# EAGLE design Flipflop  (EAGLE 9.3.0)
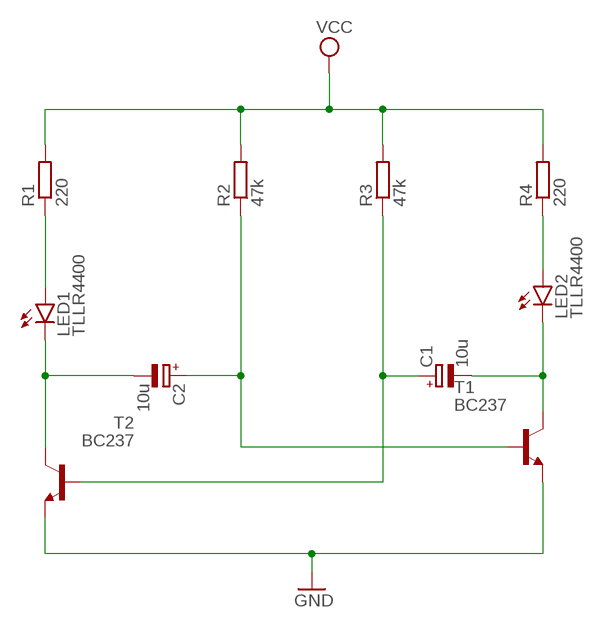
[diagram p0: schematic, sheet 1]

## Parts
C1  10u  CPOL-EU140CLH-1014  [140CLH-1014]
C2  10u  CPOL-EU140CLH-1014  [140CLH-1014]
LED1  TLLR4400  [LED3MM]
LED2  TLLR4400  [LED3MM]
R1  220  R-EU_0207/12  [0207/12]
R2  47k  R-EU_0207/12  [0207/12]
R3  47k  R-EU_0207/12  [0207/12]
R4  220  R-EU_0207/12  [0207/12]
T1  BC237  [TO92]
T2  BC237  [TO92]

## Nets
GND: T1.1(E) T2.1(E)
N$2: LED1.A R1.1
N$3: C2.- LED1.K(C) T2.3(C)
N$4: LED2.A R4.1
N$5: C1.- LED2.K(C) T1.3(C)
N$7: C1.+ R3.1 T2.2(B)
N$8: C2.+ R2.1 T1.2(B)
VCC: R1.2 R2.2 R3.2 R4.2

## Library data of the parts
C1 C2 = rcl:CPOL-EU: POLARIZED CAPACITOR, European symbol; SPICEPREFIX: C
LED1 LED2 = led:TLLR4400: Low Current (2mA) LED 3 mm Tinted Diffused Package color RED Source: Data sheet <http://www.farnell.com/datasheets/391100.pdf>; MF: VISHAY SEMICONDUCTOR; OC_FARNELL: 1612437
R1-R4 = rcl:R-EU_: RESISTOR, European symbol; SPICEPREFIX: R
T1 T2 = transistor:BC237: NPN TRANSISTOR

## Board
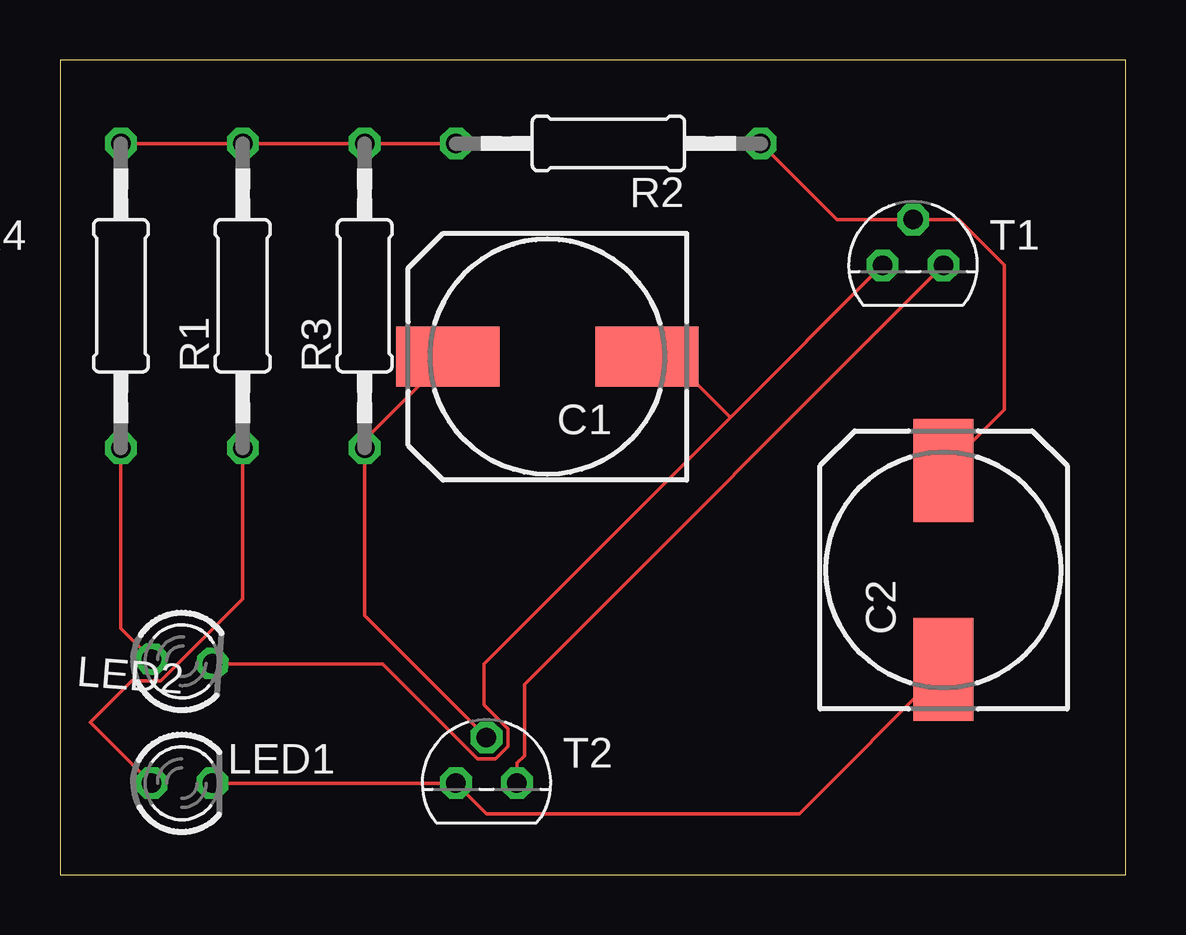
[diagram p1: board, top side]

Size 44.43 x 33.96 mm. Coordinates in mm from the lower left corner, seen from the top.
Outline: 0,0 44.43,0 44.43,33.96 0,33.96 0,0
Copper layers (1*16): Top 0.035mm / dielectric 1.5mm / Bottom 0.035mm
Design rules "default": minimum track width 6mil, minimum drill 0.35mm, track to track 6mil, track to pad 6mil, pad to pad 6mil, via to via 6mil, smd to smd 6mil, copper to edge 40mil, drill to drill 6mil, minimum pad ring 10mil, minimum via ring 8mil, stop-mask expansion 4mil, vias tented up to drill 0mil, thermal gap 10mil

### Footprints (pad centres in the part's own frame; a part is rotated, then mirrored left to right if it is on the bottom)
140CLH-1014 = smd 4.3 x 2.5: + 4.15,0; - -4.15,0
LED3MM = drill 0.813 octagon: A -1.27,0; K 1.27,0
0207/12 = drill 0.813 octagon: 1 -6.35,0; 2 6.35,0
TO92 = drill 0.813 octagon: 1 1.27,0; 2 0,1.905; 3 -1.27,0

### Placement (x,y rotation side)
C1  20.32,21.59 180 top
C2  36.83,12.7 90 top
LED1  5.08,3.81 0 top
LED2  5.08,8.89 355.6 top
R1  7.62,24.13 90 top
R2  22.86,30.48 180 top
R3  12.7,24.13 90 top
R4  2.54,24.13 90 top
T1  35.56,25.4 0 top
T2  17.78,3.81 0 top

### Tracks (layer width: path | path; a pad name or v marks a point on that pad's centre or on a via)
GND
  Top 0.152: T1.1 19.36,7.92 19.36,4.95 19.05,4.65 T2.1
N$2
  Top 0.152: R1.1 7.62,11.5 4.19,8.07 2.99,8.07 1.27,6.35 LED1.A
N$3
  Top 0.152: LED1.K T2.3 17.78,2.54 30.82,2.54 C2.-
N$4
  Top 0.152: R4.1 2.54,10.26 LED2.A
N$5
  Top 0.152: 27.94,19.05 17.68,8.79 17.68,7.07 18.67,6.08 18.67,5.35 18.15,4.83 17.41,4.83 13.45,8.79 LED2.K | 27.94,19.05 25.4,21.59 C1.- | T1.3 27.94,19.05
N$7
  Top 0.152: T2.2 12.7,10.79 R3.1 12.7,18.12 C1.+
N$8
  Top 0.152: R2.1 32.38,27.3 T1.2 37.47,27.3 39.37,25.4 39.37,19.39 C2.+
VCC
  Top 0.152: R4.2 R1.2 R3.2 R2.2